# Altium schematic sheet ClosedLoop_Drive_PowerSupply.SchDoc
size A4; SheetNumber: 3; SheetTotal: 8
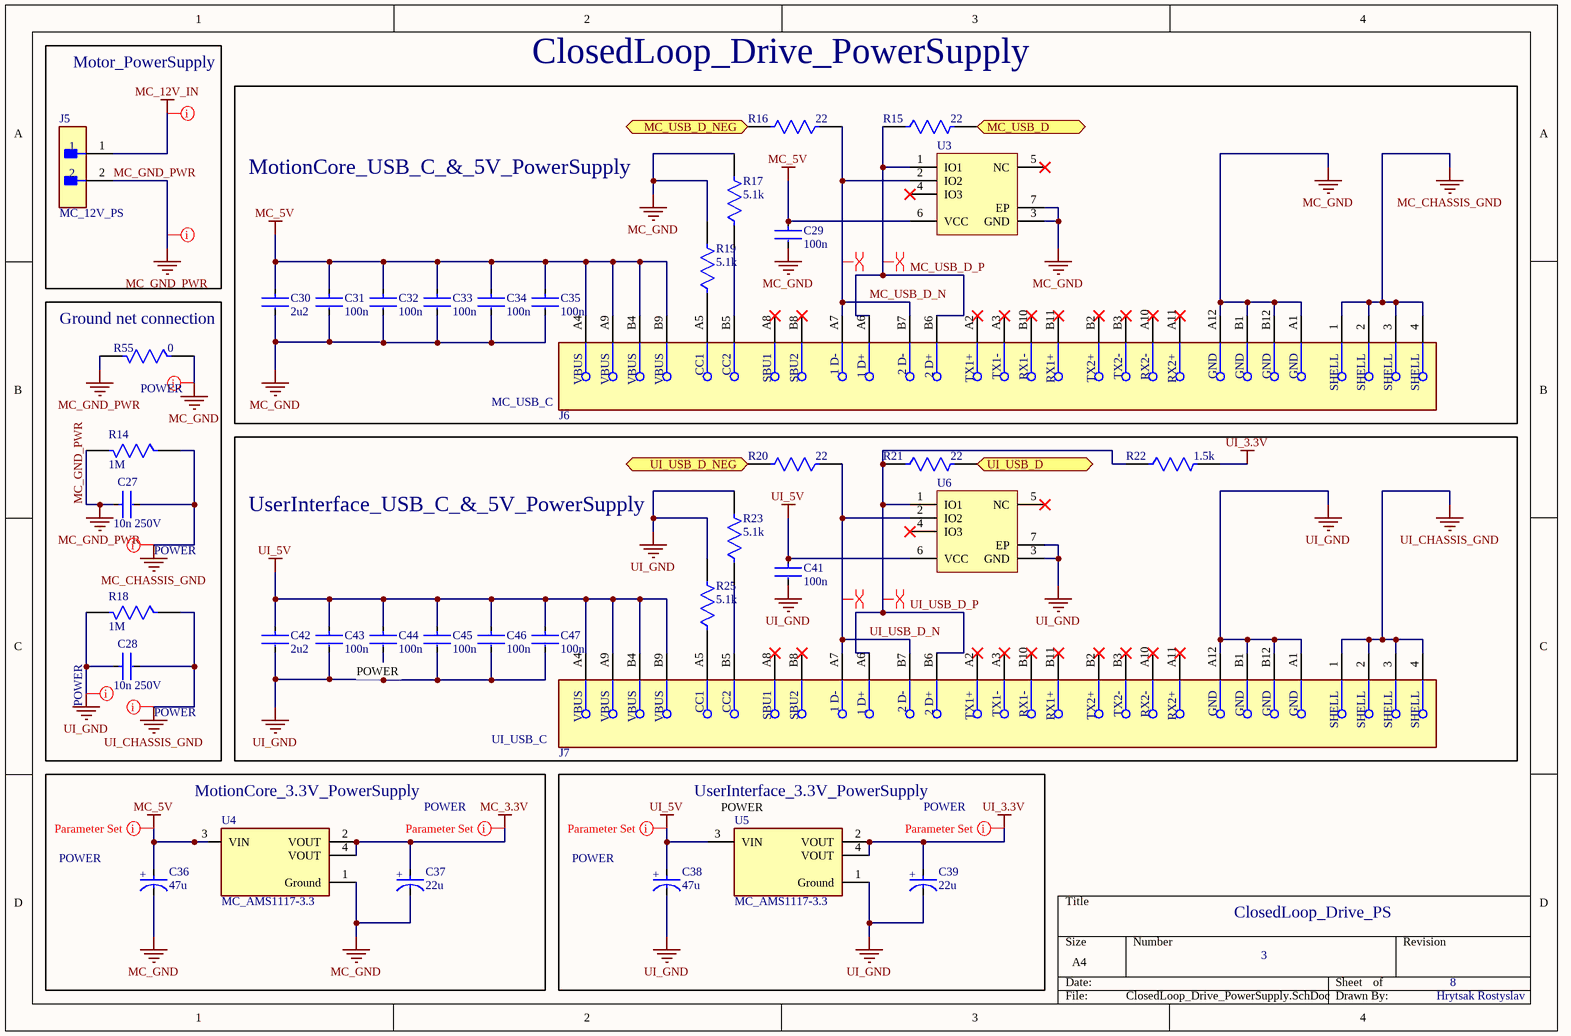
[diagram p0: ClosedLoop_Drive_PowerSupply.SchDoc]

## Parts
C27  10n 250V  [FP-0805-L_2_01_0_2-W_1_25-MFG]
C28  10n 250V  [FP-0805-L_2_01_0_2-W_1_25-MFG]
C29  100n  [FP-0805-L_2_01_0_2-W_1_25-MFG]
C30  2u2  [FP-0805-L_2_01_0_2-W_1_25-MFG]
C31  100n  [FP-0805-L_2_01_0_2-W_1_25-MFG]
C32  100n  [FP-0805-L_2_01_0_2-W_1_25-MFG]
C33  100n  [FP-0805-L_2_01_0_2-W_1_25-MFG]
C34  100n  [FP-0805-L_2_01_0_2-W_1_25-MFG]
C35  100n  [FP-0805-L_2_01_0_2-W_1_25-MFG]
C36  47u  [FP-RAD-TH-D_6_3_0_5-L_11-MFG]
C37  22u  [FP-RAD-TH-D_6_3_0_5-L_11-MFG]
C38  47u  [FP-RAD-TH-D_6_3_0_5-L_11-MFG]
C39  22u  [FP-RAD-TH-D_6_3_0_5-L_11-MFG]
C41  100n  [FP-0805-L_2_01_0_2-W_1_25-MFG]
C42  2u2  [FP-0805-L_2_01_0_2-W_1_25-MFG]
C43  100n  [FP-0805-L_2_01_0_2-W_1_25-MFG]
C44  100n  [FP-0805-L_2_01_0_2-W_1_25-MFG]
C45  100n  [FP-0805-L_2_01_0_2-W_1_25-MFG]
C46  100n  [FP-0805-L_2_01_0_2-W_1_25-MFG]
C47  100n  [FP-0805-L_2_01_0_2-W_1_25-MFG]
J5  MC_12V_PS  [FP-TSW-102-07-F-S-MFG]
J6  MC_USB_C  [FP-12401832E402A-MFG]
J7  UI_USB_C  [FP-12401832E402A-MFG]
R14  1M  [FP-MCU0805-IPC_A]
R15  22  [FP-MCU0805-IPC_A]
R16  22  [FP-MCU0805-IPC_A]
R17  5.1k  [FP-MCU0805-IPC_A]
R18  1M  [FP-MCU0805-IPC_A]
R19  5.1k  [FP-MCU0805-IPC_A]
R20  22  [FP-MCU0805-IPC_A]
R21  22  [FP-MCU0805-IPC_A]
R22  1.5k  [FP-MCU0805-IPC_A]
R23  5.1k  [FP-MCU0805-IPC_A]
R25  5.1k  [FP-MCU0805-IPC_A]
R55  0  [FP-MCU0805-IPC_A]
U3  (no value)  [DRS0006A_V]
U4  MC_AMS1117-3.3  [FP-AMS1117-IPC_C]
U5  MC_AMS1117-3.3  [FP-AMS1117-IPC_C]
U6  (no value)  [DRS0006A_V]

## Blocks framed on the sheet
Motor_PowerSupply: J5
ClosedLoop_Drive_PowerSupply: C29-C35 J6 R15-R17 R19 U3
Ground net connection: C27 C28 R14 R18 R55
UserInterface_USB_C_&_5V_PowerSupply: C41-C47 J7 R20-R23 R25 U6
MotionCore_3.3V_PowerSupply: C36 C37 U4
UserInterface_3.3V_PowerSupply: C38 C39 U5

## Ports
MC_USB_D (bidir, see ClosedLoop_Drive_MotionCore[1C]), MC_USB_D_NEG (bidir, see ClosedLoop_Drive_MotionCore[1C]), UI_USB_D (bidir, see ClosedLoop_Drive_UserInterface[1C]), UI_USB_D_NEG (bidir, see ClosedLoop_Drive_UserInterface[1C])

## Nets
MC_3.3V: C37.2(A) U4.2(VOUT) U4.4(VOUT)
MC_5V: C29.1 C30.1 C31.1 C32.1 C33.1 C34.1 C35.1 C36.2(A) J6.A4(VBUS) J6.A9(VBUS) J6.B4(VBUS) J6.B9(VBUS) U3.6(VCC) U4.3(VIN)
MC_12V_IN: J5.1
MC_CHASSIS_GND: C27.2 J6.1(SHELL) J6.2(SHELL) J6.3(SHELL) J6.4(SHELL) R14.1
MC_GND: C29.2 C30.2 C31.2 C32.2 C33.2 C34.2 C35.2 C36.1(C) C37.1(C) J6.A1(GND) J6.A12(GND) J6.B1(GND) J6.B12(GND) R17.2 R19.2 R55.1 U3.3(GND) U3.7(EP) U4.1(Ground)
MC_GND_PWR: C27.1 J5.2 R14.2 R55.2
UI_3.3V: C39.2(A) R22.2 U5.2(VOUT) U5.4(VOUT)
UI_5V: C38.2(A) C41.1 C42.1 C43.1 C44.1 C45.1 C46.1 C47.1 J7.A4(VBUS) J7.A9(VBUS) J7.B4(VBUS) J7.B9(VBUS) U5.3(VIN) U6.6(VCC)
UI_CHASSIS_GND: C28.2 J7.1(SHELL) J7.2(SHELL) J7.3(SHELL) J7.4(SHELL) R18.1
UI_GND: C28.1 C38.1(C) C39.1(C) C41.2 C42.2 C43.2 C44.2 C45.2 C46.2 C47.2 J7.A1(GND) J7.A12(GND) J7.B1(GND) J7.B12(GND) R18.2 R23.2 R25.2 U5.1(Ground) U6.3(GND) U6.7(EP)
MC_USB_D: R15.2 ; port MC_USB_D
MC_USB_D_N: J6.A7(1_D-) J6.B7(2_D-) R16.1 U3.2(IO2)
MC_USB_D_NEG: R16.2 ; port MC_USB_D_NEG
MC_USB_D_P: J6.A6(1_D+) J6.B6(2_D+) R15.1 U3.1(IO1)
UI_USB_D: R21.2 ; port UI_USB_D
UI_USB_D_N: J7.A7(1_D-) J7.B7(2_D-) R20.1 U6.2(IO2)
UI_USB_D_NEG: R20.2 ; port UI_USB_D_NEG
UI_USB_D_P: J7.A6(1_D+) J7.B6(2_D+) R21.1 R22.1 U6.1(IO1)
NetJ6_A5: J6.A5(CC1) R19.1
NetJ6_B5: J6.B5(CC2) R17.1
NetJ7_A5: J7.A5(CC1) R25.1
NetJ7_B5: J7.B5(CC2) R23.1

Not connected (* = marked no-connect by the designer): J6 A2(TX1+)* A3(TX1-)* A8(SBU1)* A10(RX2-)* A11(RX2+)* B2(TX2+)* B3(TX2-)* B8(SBU2)* B10(RX1-)* B11(RX1+)*; J7 A2(TX1+)* A3(TX1-)* A8(SBU1)* A10(RX2-)* A11(RX2+)* B2(TX2+)* B3(TX2-)* B8(SBU2)* B10(RX1-)* B11(RX1+)*; U3 4(IO3)* 5(NC)*; U6 4(IO3)* 5(NC)*

## Layout directives
CompClassName: POWER; net class POWER: MC_3.3V, MC_5V, UI_3.3V, UI_5V
differential pair: MC_USB_D_N, MC_USB_D_P, UI_USB_D_N, UI_USB_D_P
rule Supply Nets [Voltage = 0.000]; net class POWER: MC_12V_IN, MC_GND_PWR
CompClassName: POWER; rule Supply Nets [Voltage = 0.000]; net class POWER: MC_CHASSIS_GND, MC_GND, UI_CHASSIS_GND, UI_GND

## Notes on the sheet
- MotionCore_USB_C_&_5V_PowerSupply
- (near C44) POWER
- (near U5) POWER
- ClosedLoop_Drive_PS
- 3
- 8
- Hrytsak Rostyslav
- (in symbol CMP-05427-000141-1) +

## Library data of the parts
C27-C35 C41-C47 = CMP-07738-122049624-1: 0805; Tolerance: 10%; Dielectric: X7R; Material: Ceramic; Voltage Rating (DC): 100V; Capacitance: 1µF; Case/Package: 0805; Height: 1.4mm; Voltage Rating: 100V; Schedule B: 8532240020; NexarPartId: 122049624; RoHS: Compliant; Lifecycle Status: Production; Min Operating Temperature: -55°C; Max Operating Temperature: 125°C
C36-C39 = CMP-05427-000141-1: Aluminum Electrolytic Capacitors (Radial Lead Type) AEC-Q200 Qualified 100uF ±20% 25V; Lead Diameter: 0.5mm; Life (Hours): 1000Hour; Ripple Current: 130mA; Lead/Base Style: Straight; Construction: RADIAL; Radiation Hardening: No; Packaging: Ammo Pack; Termination: Radial; Mount: Through Hole; Lead Pitch: 2.5mm; Tolerance: 20%; Height - Seated (Max): 0.48inch; Height: 11.2mm; Max Operating Temperature: 105°C; Length: 11.2mm; Diameter: 6.3mm; RoHS Compliant: Yes; Voltage Rating: 25V; Min Operating Temperature: -55°C; Package Quantity: 2000; Capacitance: 100uF; Width: 6.3mm; Voltage Rating (DC): 25V; Series: NHG; Contact Plating: Tin; Case/Package: Radial
J5 = CMP-02766-001458-1: CONN HEADER VERT 2POS 2.54MM; Gender: Male; Max Current Rating: 7.6A; Number of Contacts: 2; Max Voltage Rating (AC): 550V; Orientation: Straight; Depth: 2.54mm; Series: TSW; Package Quantity: 1; Min Operating Temperature: -55°C; Max Operating Temperature: 125°C; Contact Type: Male Pin; Contact Shape: Square; Color: Black; Housing Color: Black; Connector Type: Header; Fastening Type: Pull; Radiation Hardening: No; Pitch: 2.54mm; Housing Material: Polyester; Mount: Through Hole; Number of Positions: 2; Number of Rows: 1; Contact Material: Bronze; Insulation Color: Black; Contact Finish - Mating: GOLD; Termination: Solder; Insulation Material: PBT; Length: 5.08mm; Flammability Rating: UL94 V-0; Contact Mating Length: 0.23inch; REACH SVHC: No SVHC; Contact Plating: Gold; RoHS Compliant: Yes; Packaging: Bulk
J6 J7 = CMP-02355-000004-1: CONN RCP USB3.1 TYPEC 24P SMD RA
R14-R23 R25 R55 = CMP-02407-001153-1: 0805; Power Rating: 200mW; Temperature Coefficient: 25ppm/°C; Voltage Rating: 150V; Resistance: 4.99kR; Tolerance: 0.5%; Case Code (Imperial): 0805; Features: Automotive AEC-Q200; Case Code (Metric): 2012; Weight: 0.000162oz; Width: 0.049inch; Packaging: Tape and Reel; Composition: Thin Film; Height: 0.024inch; Termination: SMD/SMT; Number of Terminations: 2; Min Operating Temperature: -55°C; Length: 0.079inch; Package Quantity: 5000; Max Operating Temperature: 175°C; Case/Package: 0805; Max Power Dissipation: 200mW
U3 U6 = CMP-0326-00043-3: Low-Capacitance + / - 15 kV ESD-Protection Array for High-Speed Data Interfaces, 3 Channels, -40 to +85 degC, 6-pin SON (DRS), Green (RoHS & no Sb/Br); Manufacturer: Texas Instruments; PartNumber: TPD3E001DRSR; Breakdown Voltage(Min)(V): 11; USB High Speed: TRUE; IO Capacitance(Typ)(pF): 1.5; IEC 61000-4-2 Air-Gap(+/- kV): 15; IEC 61000-4-2 Contact(+/- kV): 8; IO Leakage Current(nA): 1; SubFamily: ESD Solution; ComponentLink1URL: http://www.ti.com/; PackageVersion: revF, Jul-2011; ComponentLink2Description: Datasheet; PackageDescription: 6-Pin Plastic Small Outline No-Lead, 3 x 3 x 0.8 mm Body, 0.95 mm Pitch; Mounting Technology: Surface Mount; DatasheetVersion: SLLS683D; ComponentLink3URL: SamplesURL:http://www.ti.com/product/tpd3e001#samples; ComponentLink2URL: http://www.ti.com/general/docs/lit/getliterature.tsp?genericPartNumber=TPD3E001&fileType=pdf; ComponentLink1Description: Manufacturer URL; ComponentLink3Description: URL Link1; PackageReference: DRS0006A; Eco-Plan: Green (RoHS & no Sb/Br)
U4 U5 = CMP-209535-000001-1: LDO Voltage Regulators 1A, 3.3V; Manufacturer: Advanced Monolithic Systems; Dropout Voltage: 1.1V; Output Type: Fixed; Nominal Supply Current: 5mA; Max Power Dissipation: 1.2W; Max Supply Voltage: 15V; Number Of Outputs: 1; Standoff Height: 0.64mm; Max Junction Temp: +125°C; Height: 1.8mm; Package: AMS1117; Device Class L2: Power Management ICs; ComponentLink2Description: Datasheet; ComponentLink2URL: http://www.advanced-monolithic.com/pdf/ds1117.pdf; Category: IC; RoHS: TRUE; Automotive: No; Device Class L1: Integrated Circuits (ICs); Output Current: 1A; Device Class L3: Voltage Regulators - Linear; Temperature: -40°C to +125°C; Output Voltage: 3.3V; Manufacturer Part Number: AMS1117-3.3; Temperature Range Low: -40°C; Octopart: https://octopart.com/ams1117-3.3-advanced+monolithic+systems-25899300; Lead Free: Yes; Ipc Land Pattern Name: SOT229P700X180-4; Temperature Range High: +125°C